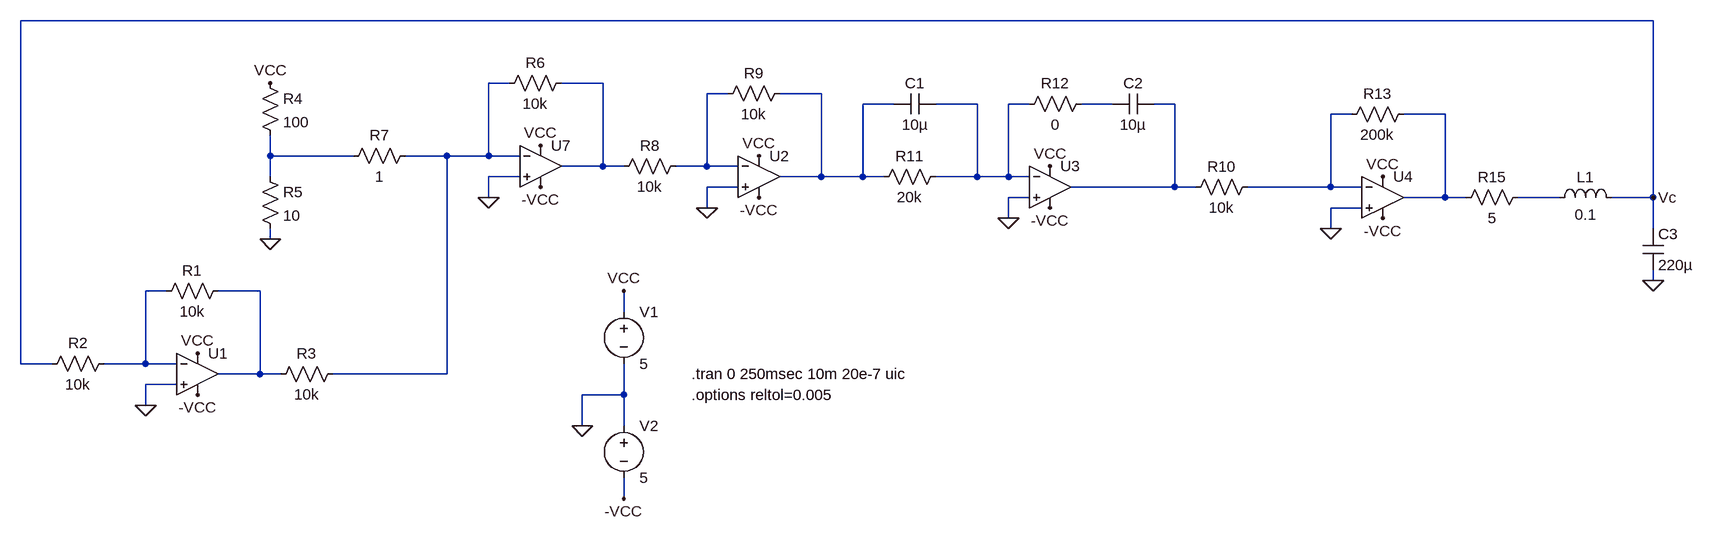
[diagram p0: schematic PID_ElementosPasivos.asc]
PID_ElementosPasivos.asc, the LTspice schematic file:
Version 4.1
SHEET 1 2104 692
WIRE 1920 -176 -592 -176
WIRE 160 -80 128 -80
WIRE 304 -80 240 -80
WIRE 496 -64 464 -64
WIRE 640 -64 576 -64
WIRE 752 -48 704 -48
WIRE 880 -48 816 -48
WIRE 960 -48 928 -48
WIRE 1088 -48 1040 -48
WIRE 1184 -48 1152 -48
WIRE 1456 -32 1424 -32
WIRE 1600 -32 1536 -32
WIRE -208 32 -208 0
WIRE -80 32 -208 32
WIRE 64 32 0 32
WIRE 128 32 128 -80
WIRE 128 32 64 32
WIRE 176 32 128 32
WIRE 304 48 304 -80
WIRE 304 48 240 48
WIRE 336 48 304 48
WIRE 464 48 464 -64
WIRE 464 48 416 48
WIRE 512 48 464 48
WIRE -208 64 -208 32
WIRE 176 64 128 64
WIRE 640 64 640 -64
WIRE 640 64 576 64
WIRE 704 64 704 -48
WIRE 704 64 640 64
WIRE 736 64 704 64
WIRE 880 64 880 -48
WIRE 880 64 816 64
WIRE 928 64 928 -48
WIRE 928 64 880 64
WIRE 960 64 928 64
WIRE 512 80 464 80
WIRE 1184 80 1184 -48
WIRE 1184 80 1024 80
WIRE 1216 80 1184 80
WIRE 1424 80 1424 -32
WIRE 1424 80 1296 80
WIRE 1472 80 1424 80
WIRE 128 96 128 64
WIRE 960 96 928 96
WIRE 1600 96 1600 -32
WIRE 1600 96 1536 96
WIRE 1632 96 1600 96
WIRE 1776 96 1712 96
WIRE 1920 96 1920 -176
WIRE 1920 96 1856 96
WIRE 464 112 464 80
WIRE 1472 112 1424 112
WIRE 928 128 928 96
WIRE 1424 144 1424 112
WIRE 1920 144 1920 96
WIRE -208 160 -208 144
WIRE 1920 224 1920 208
WIRE -368 240 -400 240
WIRE -224 240 -288 240
WIRE 336 272 336 240
WIRE -592 352 -592 -176
WIRE -544 352 -592 352
WIRE -400 352 -400 240
WIRE -400 352 -464 352
WIRE -352 352 -400 352
WIRE -224 368 -224 240
WIRE -224 368 -288 368
WIRE -192 368 -224 368
WIRE 64 368 64 32
WIRE 64 368 -112 368
WIRE -352 384 -400 384
WIRE 336 400 336 352
WIRE 336 400 272 400
WIRE -400 416 -400 384
WIRE 272 448 272 400
WIRE 336 448 336 400
WIRE 336 560 336 528
FLAG -400 416 0
FLAG 272 448 0
FLAG 336 240 VCC
FLAG 336 560 -VCC
FLAG -320 336 VCC
FLAG -320 400 -VCC
FLAG -208 160 0
FLAG -208 -80 VCC
FLAG 128 96 0
FLAG 208 16 VCC
FLAG 208 80 -VCC
FLAG 464 112 0
FLAG 544 32 VCC
FLAG 544 96 -VCC
FLAG 928 128 0
FLAG 1424 144 0
FLAG 1504 64 VCC
FLAG 1504 128 -VCC
FLAG 1920 224 0
FLAG 992 48 VCC
FLAG 992 112 -VCC
FLAG 1920 96 Vc
SYMBOL OpAmps\\UniversalOpAmp2 -320 368 R0
SYMATTR InstName U1
SYMBOL res -272 224 R90
WINDOW 0 0 56 VBottom 2
WINDOW 3 32 56 VTop 2
SYMATTR InstName R1
SYMATTR Value 10k
SYMBOL res -448 336 R90
WINDOW 0 0 56 VBottom 2
WINDOW 3 32 56 VTop 2
SYMATTR InstName R2
SYMATTR Value 10k
SYMBOL res -96 352 R90
WINDOW 0 0 56 VBottom 2
WINDOW 3 32 56 VTop 2
SYMATTR InstName R3
SYMATTR Value 10k
SYMBOL voltage 336 256 R0
WINDOW 123 0 0 Left 0
WINDOW 39 0 0 Left 0
SYMATTR InstName V1
SYMATTR Value 5
SYMBOL voltage 336 432 R0
WINDOW 123 0 0 Left 0
WINDOW 39 0 0 Left 0
SYMATTR InstName V2
SYMATTR Value 5
SYMBOL res -224 -96 R0
SYMATTR InstName R4
SYMATTR Value 100
SYMBOL res -224 48 R0
SYMATTR InstName R5
SYMATTR Value 10
SYMBOL OpAmps\\UniversalOpAmp2 208 48 R0
SYMATTR InstName U7
SYMBOL res 256 -96 R90
WINDOW 0 0 56 VBottom 2
WINDOW 3 32 56 VTop 2
SYMATTR InstName R6
SYMATTR Value 10k
SYMBOL res 16 16 R90
WINDOW 0 0 56 VBottom 2
WINDOW 3 32 56 VTop 2
SYMATTR InstName R7
SYMATTR Value 1
SYMBOL res 432 32 R90
WINDOW 0 0 56 VBottom 2
WINDOW 3 32 56 VTop 2
SYMATTR InstName R8
SYMATTR Value 10k
SYMBOL OpAmps\\UniversalOpAmp2 544 64 R0
SYMATTR InstName U2
SYMBOL res 592 -80 R90
WINDOW 0 0 56 VBottom 2
WINDOW 3 32 56 VTop 2
SYMATTR InstName R9
SYMATTR Value 10k
SYMBOL res 832 48 R90
WINDOW 0 0 56 VBottom 2
WINDOW 3 32 56 VTop 2
SYMATTR InstName R11
SYMATTR Value 20k
SYMBOL cap 816 -64 R90
WINDOW 0 0 32 VBottom 2
WINDOW 3 32 32 VTop 2
SYMATTR InstName C1
SYMATTR Value 10µ
SYMBOL OpAmps\\UniversalOpAmp2 992 80 R0
SYMATTR InstName U3
SYMBOL res 1312 64 R90
WINDOW 0 0 56 VBottom 2
WINDOW 3 32 56 VTop 2
SYMATTR InstName R10
SYMATTR Value 10k
SYMBOL res 1056 -64 R90
WINDOW 0 0 56 VBottom 2
WINDOW 3 32 56 VTop 2
SYMATTR InstName R12
SYMATTR Value 0
SYMBOL cap 1152 -64 R90
WINDOW 0 0 32 VBottom 2
WINDOW 3 32 32 VTop 2
SYMATTR InstName C2
SYMATTR Value 10µ
SYMBOL OpAmps\\UniversalOpAmp2 1504 96 R0
SYMATTR InstName U4
SYMBOL res 1552 -48 R90
WINDOW 0 0 56 VBottom 2
WINDOW 3 32 56 VTop 2
SYMATTR InstName R13
SYMATTR Value 200k
SYMBOL res 1728 80 R90
WINDOW 0 0 56 VBottom 2
WINDOW 3 32 56 VTop 2
SYMATTR InstName R15
SYMATTR Value 5
SYMBOL ind 1760 112 R270
WINDOW 0 32 56 VTop 2
WINDOW 3 5 56 VBottom 2
SYMATTR InstName L1
SYMATTR Value 0.1
SYMBOL cap 1904 144 R0
SYMATTR InstName C3
SYMATTR Value 220µ
TEXT 440 368 Left 2 !.tran 0 250msec 10m 20e-7 uic
TEXT 440 400 Left 2 !.options reltol=0.005

The netlist it stands for:
* PID_ElementosPasivos.asc
X§U1 0 N012 VCC -VCC N013 level2 Avol=1Meg GBW=10Meg Slew=10Meg Ilimit=25m Rail=0 Vos=0 En=0 Enk=0 In=0 Ink=0 Rin=500Meg  ; pins In+ In- V+ V- OUT
R1 N013 N012 10k
R2 N012 Vc 10k
R3 N001 N013 10k
V1 VCC 0 5
V2 0 -VCC 5
R4 VCC N010 100
R5 N010 0 10
X§U7 0 N001 VCC -VCC N002 level2 Avol=1Meg GBW=10Meg Slew=10Meg Ilimit=25m Rail=0 Vos=0 En=0 Enk=0 In=0 Ink=0 Rin=500Meg  ; pins In+ In- V+ V- OUT
R6 N002 N001 10k
R7 N001 N010 1
R8 N003 N002 10k
X§U2 0 N003 VCC -VCC N004 level2 Avol=1Meg GBW=10Meg Slew=10Meg Ilimit=25m Rail=0 Vos=0 En=0 Enk=0 In=0 Ink=0 Rin=500Meg  ; pins In+ In- V+ V- OUT
R9 N004 N003 10k
R11 N005 N004 20k
C1 N005 N004 10µ
X§U3 0 N005 VCC -VCC N007 level2 Avol=1Meg GBW=10Meg Slew=10Meg Ilimit=25m Rail=0 Vos=0 En=0 Enk=0 In=0 Ink=0 Rin=500Meg  ; pins In+ In- V+ V- OUT
R10 N008 N007 10k
R12 N006 N005 0
C2 N007 N006 10µ
X§U4 0 N008 VCC -VCC N009 level2 Avol=1Meg GBW=10Meg Slew=10Meg Ilimit=25m Rail=0 Vos=0 En=0 Enk=0 In=0 Ink=0 Rin=500Meg  ; pins In+ In- V+ V- OUT
R13 N009 N008 200k
R15 N011 N009 5
L1 N011 Vc 0.1
C3 Vc 0 220µ
.tran 0 250msec 10m 20e-7 uic
.options reltol=0.005
.lib UniversalOpAmp2.lib
.backanno
.end